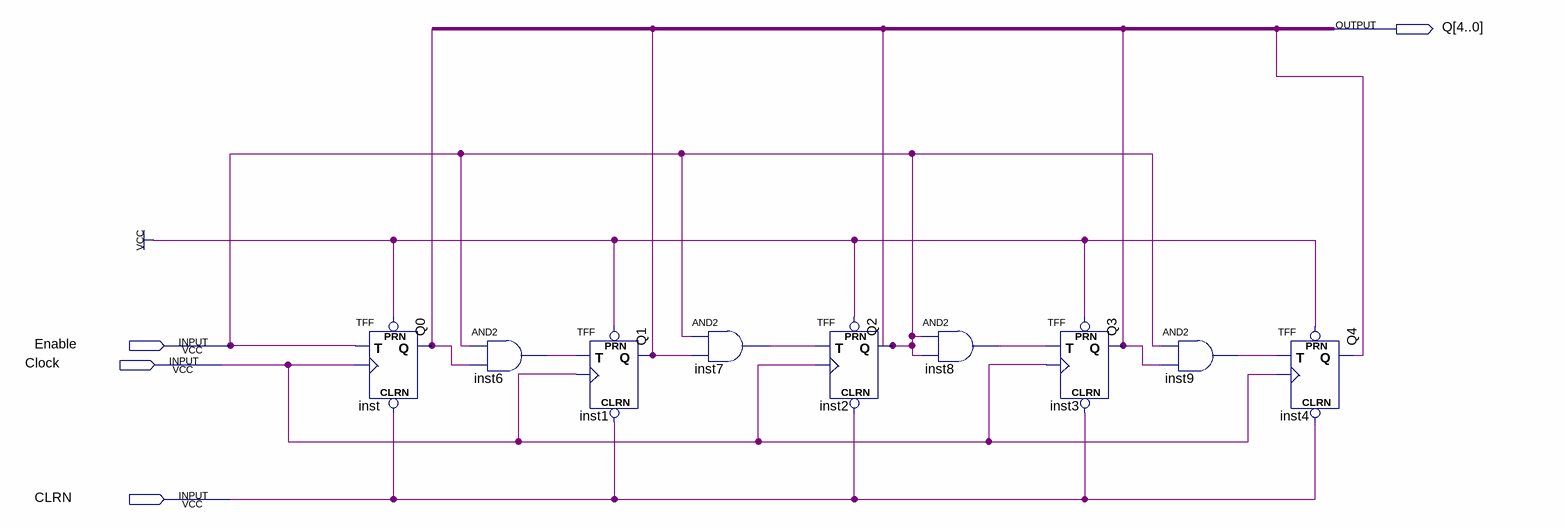
[diagram p0: schematic sheet]
// Quartus schematic lab10step2b.bdf as structural Verilog: 9 symbols, 4 pins
module lab10step2b (
  input  Enable,
  input  Clock,
  input  CLRN,
  output [4:0] Q
);

  wire inst6_out, inst7_out, inst8_out, inst9_out;

  TFF inst (.PRN(1'b1), .CLRN(CLRN), .T(Enable), .CLK(Clock), .Q(Q[0]));
  and inst6 (inst6_out, Enable, Q[0]);
  TFF inst1 (.PRN(1'b1), .CLRN(CLRN), .T(inst6_out), .CLK(Clock), .Q(Q[1]));
  and inst7 (inst7_out, Enable, Q[1]);
  TFF inst2 (.PRN(1'b1), .CLRN(CLRN), .T(inst7_out), .CLK(Clock), .Q(Enable));
  and inst8 (inst8_out, Enable, Enable);
  TFF inst3 (.PRN(1'b1), .CLRN(CLRN), .T(inst8_out), .CLK(Clock), .Q(Q[3]));
  and inst9 (inst9_out, Enable, Q[3]);
  TFF inst4 (.PRN(1'b1), .CLRN(CLRN), .T(inst9_out), .CLK(Clock), .Q(Q[4]));

  assign Q[2] = Enable;

  // Other names for the same wires on the sheet: Q2 = Enable
endmodule
